# Altium schematic sheet USB_Connector - Copy.SchDoc: RP2040 CNC
size B; Author: AM; CompanyName: Expatria Technologies; DrawnBy: A.Marles; Engineer: AM; Organization: Expatria Technolgoies; Address1: 1136 Glade Court; Address3: Port Coquitlam, BC V3B 1R5; Address4: Canada; DocumentNumber: 21; SheetNumber: 27; SheetTotal: 30
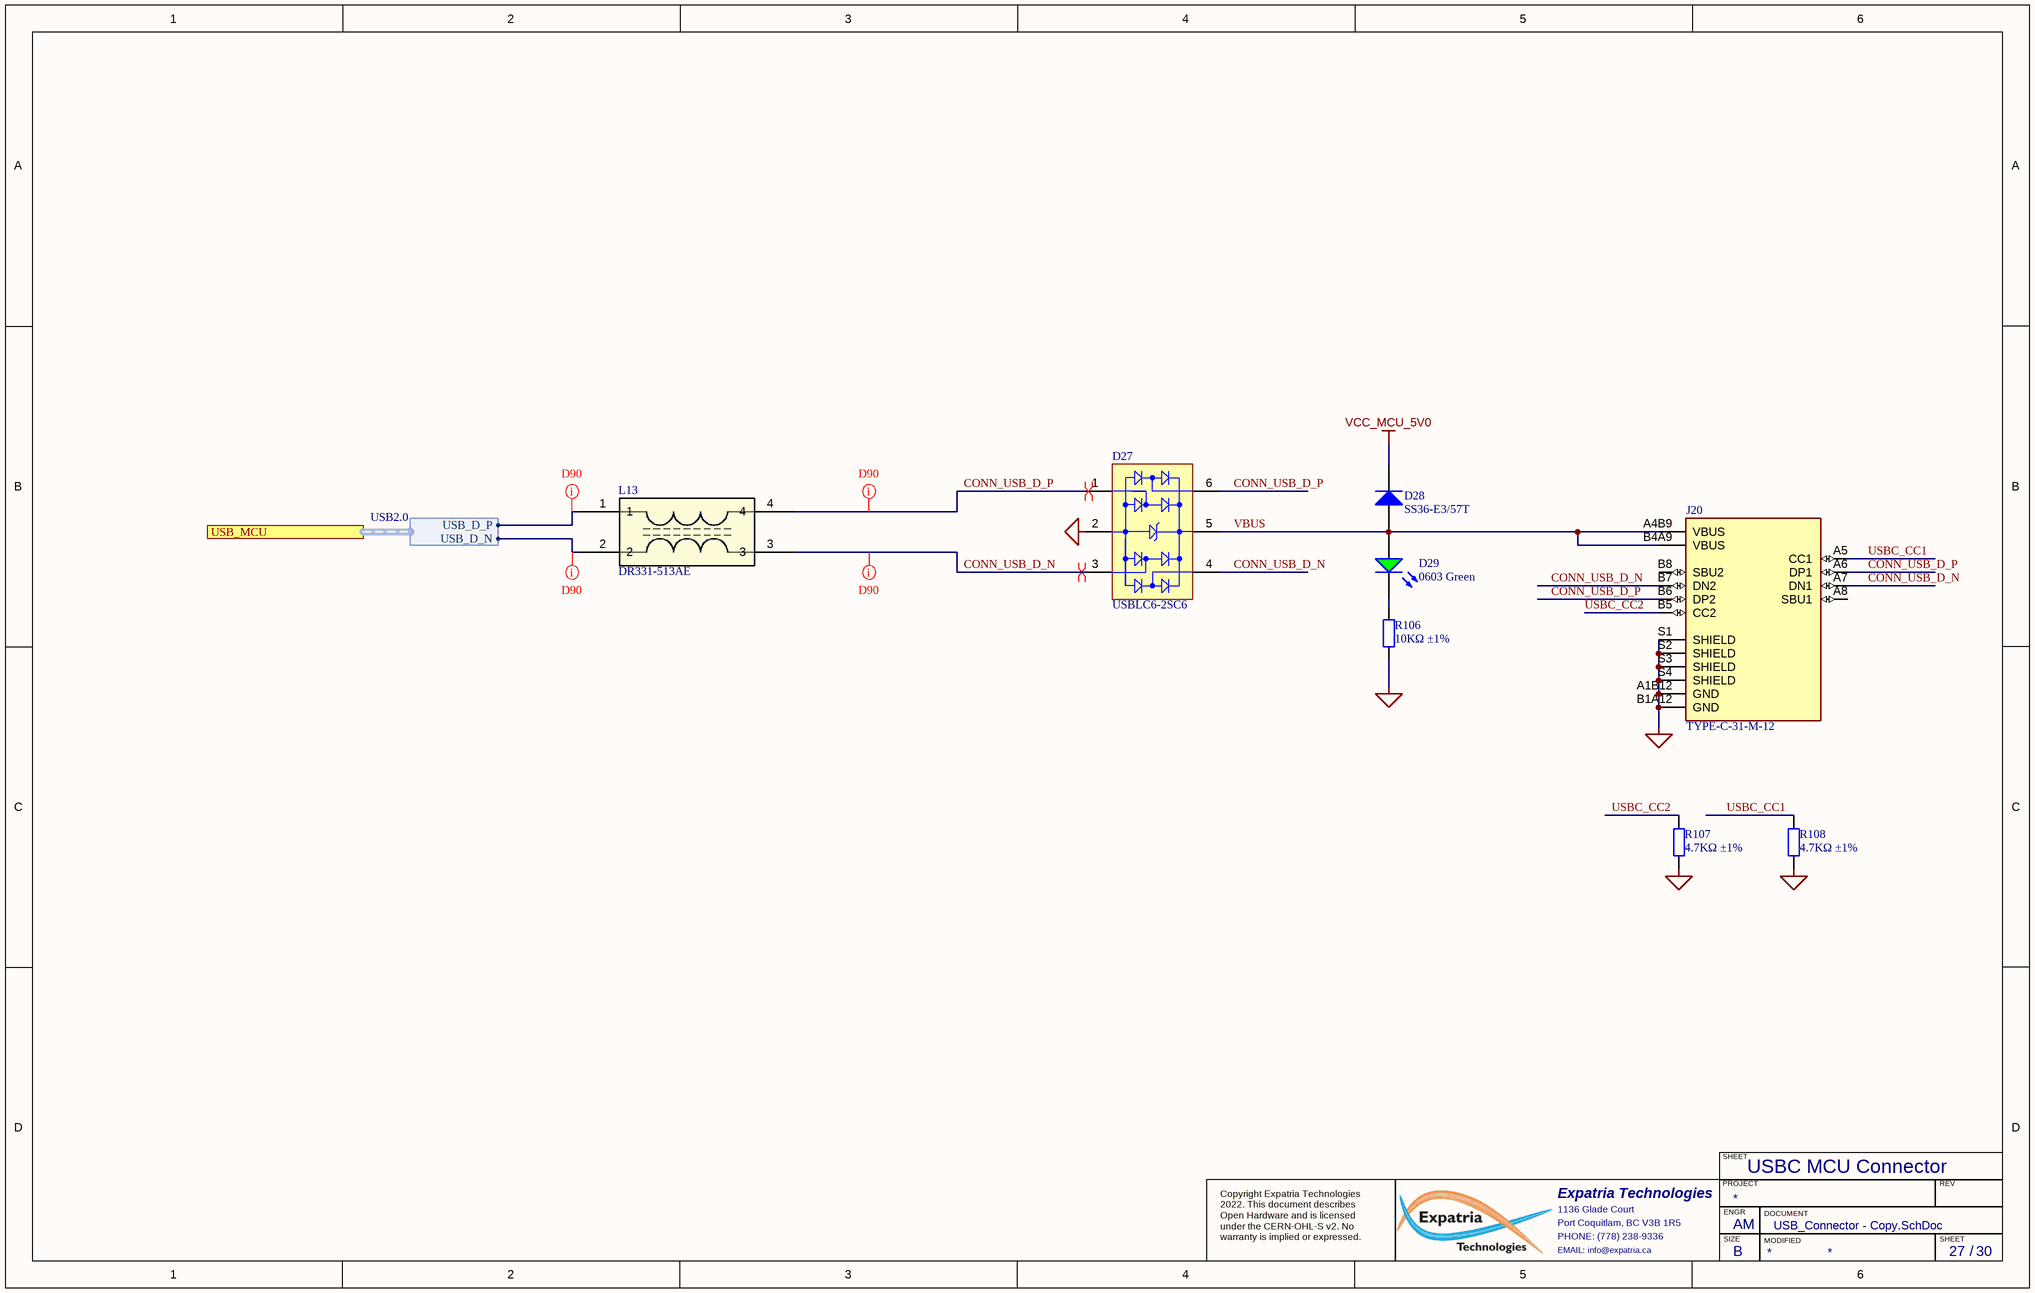
[diagram p0: USB_Connector - Copy.SchDoc]

## Parts
D27  USBLC6-2SC6  [SOT95P280X145-6N]
D28  SS36-E3/57T  [SMC(DO-214AB)_S1]
D29  0603 Green  [0603_LED_S1]
J20  TYPE-C-31-M-12  [HRO_TYPE-C-31-M-12]
L13  DR331-513AE  [IND_DR331-513AEE_BRN]
R106  10KΩ ±1%  [0603_R]
R107  4.7KΩ ±1%  [0603_R]
R108  4.7KΩ ±1%  [0603_R]

## Ports
USB_MCU (harness USB2.0)

## Harnesses
USB2.0: USB_D_P, USB_D_N

## Nets
MCU_GND: D27.2(GND) J20.A1B12(GND) J20.B1A12(GND) J20.S1(SHIELD) J20.S2(SHIELD) J20.S3(SHIELD) J20.S4(SHIELD) R106.1 R107.2 R108.2
VCC_MCU_5V0: D28.2(K)
CONN_USB_D_N: D27.3(I/O_2) D27.4(I/O_3) J20.A7(DN1) J20.B7(DN2) L13.3
CONN_USB_D_P: D27.1(I/O_1) D27.6(I/O_4) J20.A6(DP1) J20.B6(DP2) L13.4
USBC_CC1: J20.A5(CC1) R108.1
USBC_CC2: J20.B5(CC2) R107.1
VBUS: D27.5(VBUS) D28.1(A) D29.A J20.A4B9(VBUS) J20.B4A9(VBUS)
NetD29_K: D29.K R106.2
NetL13_1: L13.1 ; port USB_MCU.USB_D_P
NetL13_2: L13.2 ; port USB_MCU.USB_D_N

Not connected (* = marked no-connect by the designer): J20 A8(SBU1) B8(SBU2)

## Layout directives
differential pair: CONN_USB_D_N, CONN_USB_D_P
net class D90_NET: CONN_USB_D_N, CONN_USB_D_P, NetL13_1, NetL13_2

## Notes on the sheet
- USBC MCU Connector
- SHEET
- Expatria Technologies
- 1136 Glade Court
- Port Coquitlam, BC V3B 1R5
- PHONE: (778) 238-9336
- PROJECT
- SIZE
- ENGR
- MODIFIED
- DOCUMENT
- REV
- Copyright Expatria Technologies 2022. This document describes Open Hardware and is licensed under the CERN-OHL-S v2. No warranty is implied or expressed.
- EMAIL: info@expatria.ca
- B
- /

## Library data of the parts
D27 = USBLC6-2SC6: Very low capacitance ESD protection, 3.5 pF, -40 to 125 degC, 6-Pin SOT23, RoHS, Tape and Reel; Manufacturer: TECH PUBLIC; Polarity: Uni-Directional; Clamping Voltage: 11V; Rad Hardened: No; Product Height (mm): 1.3mm; Leakage Current (Max): 0.15uA; Product Length (mm): 3.05mm; Number of Elements: 1; Peak Pulse Current: 5A; Configuration: Dual; Reverse Breakdown Voltage: 6V; Working Voltage (Max): 5V; Capacitance Value: 3.5pF; Suppressor Type: DiodeArrays; Product Depth (mm): 1.75mm; Test Current (It): 1mA; Package / Case: SOT-23; Operating Temperature Max Deg. C: 125C; Package Description: 6-Pin Small Outline Transistor, Body 2.925 x 1.625 mm, Pitch 0.95 mm; Package Reference: SOT23-6L; Operating Temperature Min Deg. C: -40C; Mounting Style: SurfaceMount; Direction Type: Uni-Directional; Mounting: SurfaceMount; Pin Count: 6; Leakage Current: 0.15uA; Packaging: TapeandReel; Operating Temperature Classification: Automotive; Clamping Voltage (Max): 11V; Reverse Stand-off Voltage: 5V; Datasheet URL: http://www.st.com/st-web-ui/static/active/en/resource/technical/document/datasheet/CD00050750.pdf; Working Voltage: 5V; Operating Temp Range: -40Cto125C; Manufacturer Part Number: USBLC6-2SC6; SuppliersPartNumber: C2827654; Supplier: LCSC
D28 = SMC(DO-214AB) SS36-E3/57T: DIODE SCHOTTKY 60V 3A DO214AB; ComponentLink1Description: 供应商链接; ComponentLink1URL: http://www.szlcsc.com/product/details_36698.html; Package: SMC(DO-214AB); Supplier: LCSC; SuppliersPartNumber: C35722
D29 = 0603 LED Green: LED; ComponentLink1Description: 供应商链接; ComponentLink1URL: http://www.szlcsc.com/product/details_73152.html; Package: 0603; Supplier: LCSC; SuppliersPartNumber: C72043; Color: Green
J20 = TYPE-C-31-M-12: USB Connectors 24 Receptacle 1 8.94*7.3mm RoHS; MF: HRO Electronics Co., Ltd.; Value: *; SnapEDA_Link: https://www.snapeda.com/parts/TYPE-C-31-M-12/HRO%20Electronics%20Co.,%20Ltd./view-part/3228496/?ref=snap; Package: Package; MP: TYPE-C-31-M-12; Price: None; Availability: Unavailable; SuppliersPartNumber: C2765186; Supplier: LCSC
L13 = DR331-513AE: 51 µH @ 100 kHz 2 Line Common Mode Choke Surface Mount 500mA DCR 300mOhm; Manufacturer: Bourns Electronics; SuppliersPartNumber: C840596; Manufacturer Part Number: DR331-513AE; Supplier: LCSC; Value: DR331-513AE
R106 = 0603 10K (1002) 1%: Chip resistor; Manufacturer: Uniroyal Elec; PartNumber: 0603WAF1002T5E; Power: 1/10W; ComponentLink1Description: Supplier link; ComponentLink1URL: http://www.szlcsc.com/product/details_26547.html; Package: 0603; Supplier: LCSC; SuppliersPartNumber: C25804; Resistance: 10KΩ; Tolerance: 1%
R107 R108 = 0603 4.7K (4701) 1%: Chip resistor; Manufacturer: Uniroyal Elec; PartNumber: 0603WAF4701T5E; Power: 1/10W; ComponentLink1Description: Supplier link; ComponentLink1URL: http://www.szlcsc.com/product/details_23889.html; Package: 0603; Supplier: LCSC; SuppliersPartNumber: C23162; Resistance: 4.7KΩ; Tolerance: 1%